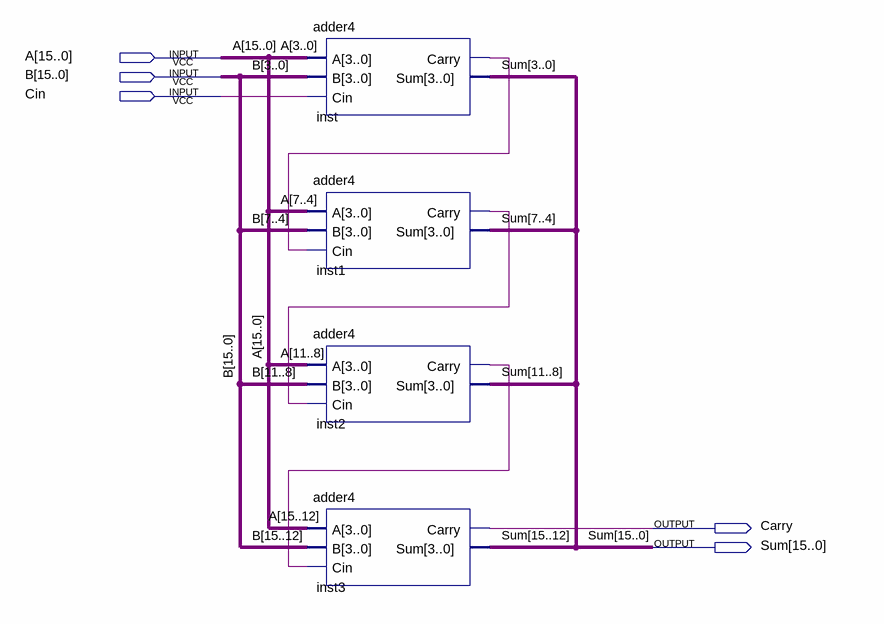
[diagram p0: schematic sheet]
// Quartus schematic adder16.bdf as structural Verilog: 4 symbols, 5 pins
module adder16 (
  input  [15:0] A,
  input  [15:0] B,
  input  Cin,
  output Carry,
  output [15:0] Sum
);

  wire inst1_carry, inst2_carry, inst_carry;

  adder4 inst (.A(A[3:0]), .B(B[3:0]), .Cin(Cin), .Carry(inst_carry), .Sum(Sum[3:0]));
  adder4 inst1 (.A(A[7:4]), .B(B[7:4]), .Cin(inst_carry), .Carry(inst1_carry), .Sum(Sum[7:4]));
  adder4 inst2 (.A(A[11:8]), .B(B[11:8]), .Cin(inst1_carry), .Carry(inst2_carry), .Sum(Sum[11:8]));
  adder4 inst3 (.A(A[15:12]), .B(B[15:12]), .Cin(inst2_carry), .Carry(Carry), .Sum(Sum[15:12]));
endmodule
